# Altium schematic sheet VOLTAGE_REGULATOR.SchDoc
size A; SheetNumber: 4; SheetTotal: 5
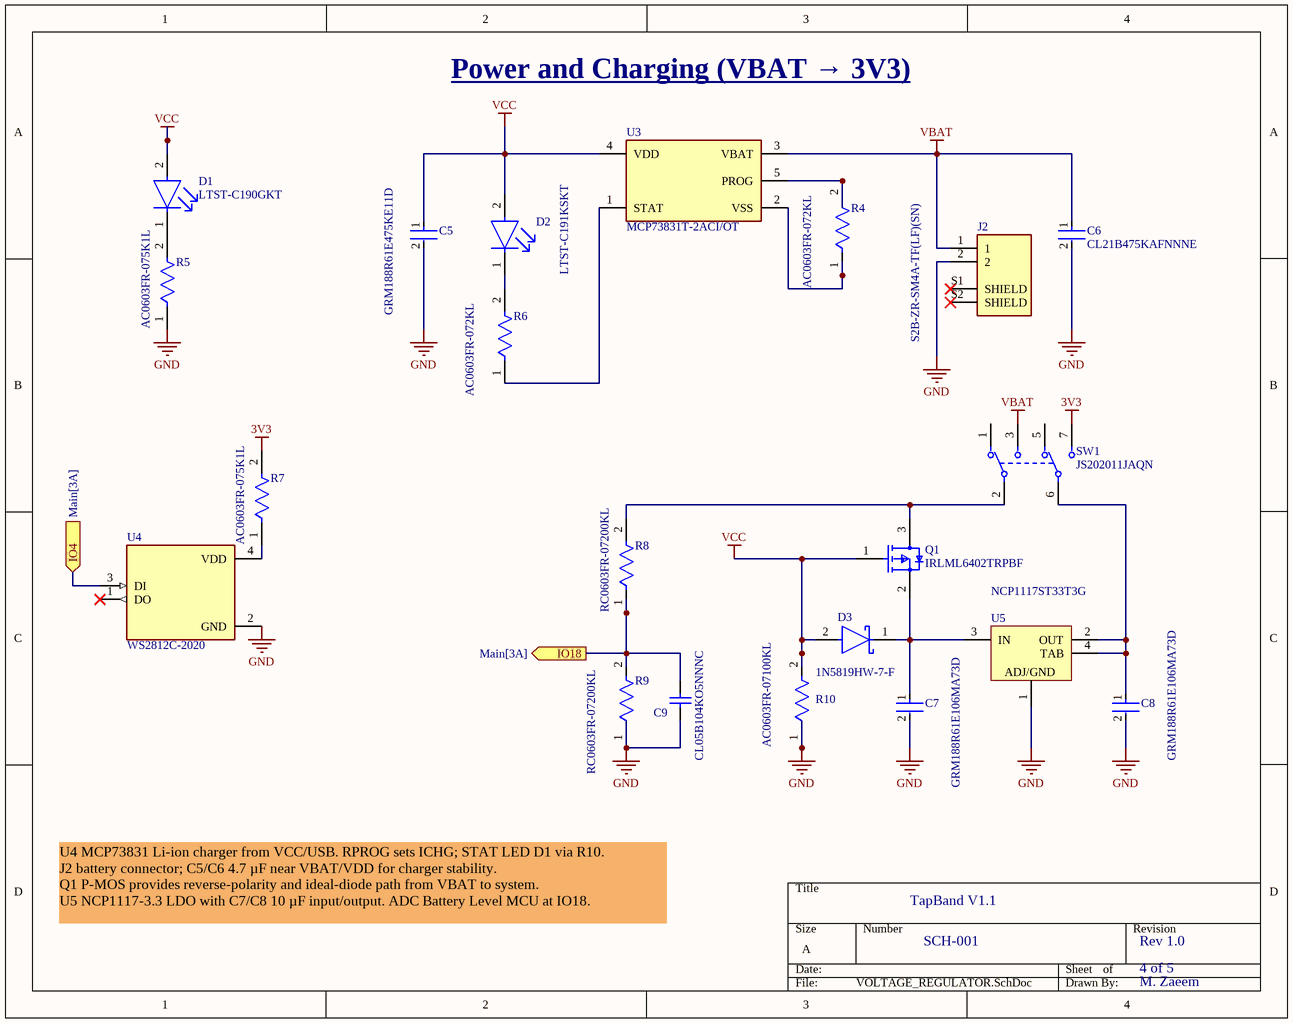
[diagram p0: VOLTAGE_REGULATOR.SchDoc]

## Parts
C5  GRM188R61E475KE11D  [FP-GRM188-0_15-IPC_C]
C6  CL21B475KAFNNNE  [FP-CL21-IPC_C]
C7  GRM188R61E106MA73D  [FP-GRM188-0_2-MFG]
C8  GRM188R61E106MA73D  [FP-GRM188-0_2-MFG]
C9  CL05B104KO5NNNC  [CAPC1050X55X23ML05T13]
D1  LTST-C190GKT  [FP-LTST-C190GKT-MFG]
D2  LTST-C191KSKT  [FP-LTST-C191KSKT-MFG]
D3  1N5819HW-7-F  [FP-SOD123-IPC_A]
J2  S2B-ZR-SM4A-TF(LF)(SN)  [JST_S2B-ZR-SM4A-TF(LF)(SN)]
Q1  IRLML6402TRPBF  [FP-Micro3-MFG]
R4  AC0603FR-072KL  [FP-AC0603-IPC_B]
R5  AC0603FR-075K1L  [FP-AC0603-MFG]
R6  AC0603FR-072KL  [FP-AC0603-IPC_B]
R7  AC0603FR-075K1L  [FP-AC0603-MFG]
R8  RC0603FR-07200KL  [FP-RC0603-0_55-IPC_B]
R9  RC0603FR-07200KL  [FP-RC0603-0_55-IPC_B]
R10  AC0603FR-07100KL  [FP-AC0603-MFG]
SW1  JS202011JAQN  [FP-JS202011JAQN-MFG]
U3  MCP73831T-2ACI/OT  [FP-C04-091-OT-MFG]
U4  WS2812C-2020  [LED_WS2812C-2020]
U5  NCP1117ST33T3G  [ONSC-SOT-223-4-318H-01_A_V]

## Ports
IO4 (in, see Main[3A]), IO18 (out, see Main[3A])

## Nets
3V3: R7.2 SW1.7
GND: C5.2 C6.2 C7.2 C8.2 C9.1 J2.2 R5.1 R9.1 R10.1 U4.2(GND) U5.1(ADJ/GND)
VBAT: C6.1 J2.1 SW1.3 U3.3(VBAT)
VCC: C5.1 D1.2(A) D2.2(A) D3.2(A) Q1.1(G) R10.2 U3.4(VDD)
IO4: U4.3(DI) ; port IO4
IO18: C9.2 R8.1 R9.2 ; port IO18
NetC7_1: C7.1 D3.1(C) Q1.2(S) U5.3(IN)
NetC8_1: C8.1 SW1.6(2_C) U5.2(OUT) U5.4(TAB)
NetD1_1: D1.1(C) R5.2
NetD2_1: D2.1(C) R6.2
NetQ1_3: Q1.3(D) R8.2 SW1.2(1_C)
NetR4_1: R4.1 U3.2(VSS)
NetR4_2: R4.2 U3.5(PROG)
NetR6_1: R6.1 U3.1(STAT)
NetR7_1: R7.1 U4.4(VDD)

Not connected (* = marked no-connect by the designer): J2 S1(SHIELD)* S2(SHIELD)*; SW1 1 5; U4 1(DO)*

## Notes on the sheet
- Power and Charging (VBAT → 3V3)
- TapBand V1.1
- U4 MCP73831 Li‑ion charger from VCC/USB. RPROG sets ICHG; STAT LED D1 via R10.
  J2 battery connector; C5/C6 4.7 µF near VBAT/VDD for charger stability.
  Q1 P‑MOS provides reverse‑polarity and ideal‑diode path from VBAT to system.
  U5 NCP1117‑3.3 LDO with C7/C8 10 µF input/output. ADC Battery Level MCU at IO18.
- SCH-001
- Rev 1.0
- 4 of 5
- M. Zaeem

## Library data of the parts
C5 = CMP-2006-02523-2: Chip Multilayer Ceramic Capacitors for General Purpose, 0603, 4.7uF, X5R, 15%, 10%, 25V; Case Code (Metric): 1608; Max Operating Temperature: 85°C; REACH SVHC: No SVHC; Voltage Rating: 25V; Dielectric: X5R; Packaging: Cut Tape; Width: 0.031inch; Min Operating Temperature: -55°C; Lead Free: Lead Free; Capacitance: 4.7uF; Height: 0.8mm; Case Code (Imperial): 0603; Length: 1.6mm; Voltage Rating (DC): 25V; Case/Package: 0603; Voltage: 25V; Tolerance: 10%; Thickness: 0.031inch; Mount: Surface Mount; Material: Ceramic; Package Quantity: 4000; Depth: 0.8mm
C6 = CMP-13271-001003-1: CL21 Series 0805 4.7uF 25V ±10% Tolerance X7R Multilayer Ceramic Chip Capacitor; Length: 0.079inch; Capacitance: 4.7uF; Max Operating Temperature: 125°C; Mount: Surface Mount; Voltage Rating (DC): 25V; Width: 0.049inch; Min Operating Temperature: -55°C; Lead Free: Lead Free; Case Code (Metric): 2012; Case/Package: 0805; Case Code (Imperial): 0805; Tolerance: 10%; Thickness: 0.053inch; Voltage Rating: 25V; Packaging: Tape and Reel
C7 C8 = CMP-2006-02520-2: Chip Multilayer Ceramic Capacitors for General Purpose, 0603, 10uF, X5R, 15%, 20%, 25V; Tolerance: 20%; Resistor Type: Ceramic; Voltage: 25V; Max Operating Temperature: 85°C; Min Operating Temperature: -55°C; Capacitance: 10uF; Dielectric: X5R; Lead Free: Lead Free; REACH SVHC: No SVHC; Case/Package: 0603; Mount: Surface Mount; Voltage Rating (DC): 25V; Height: 0.8mm; Length: 1.6mm; Thickness: 0.031inch; Width: 0.031inch; Termination: SMD/SMT; Case Code (Imperial): 0603; Case Code (Metric): 1608; Package Quantity: 1; Packaging: Tape and Reel; Depth: 0.8mm; Voltage Rating: 25V; Weight: 0.000222oz; Number of Pins: 2
C9 = CMP-2000-05439-1: Chip Capacitor, 100 nF, +/- 10%, 16 V, -55 to 125 degC, 0402 (1005 Metric), RoHS, Tape and Reel; Manufacturer: Samsung Electro-Mechanics; Capacitance: 100000pF; Dielectric: X7R; Rated Voltage: 16V; Case Size/Dimension: 0402; Tolerance (%): ±10%; Manufacturer URL: http://www.samsungsem.com/global/index.jsp; Datasheet URL: https://datasheet.ciiva.com/29198/458718-da-01-en-vs-kondensator-0402-29198423.pdf; Datasheet Version: Nov-10
D1 = CMP-22017-000005-2: LED GREEN CLEAR CHIP SMD; Dominant Wavelength: 569nm; Reverse Voltage: 5V; Lens Color: Colorless; Viewing Angle: 130°; Voltage: 2V; Forward Current: 30mA; Power Dissipation: 100mW; Luminous Intensity: 6mcd; Number of LEDs: 1; Forward Voltage: 2.1V; Wavelength: 565nm; Test Current: 10mA; Min Operating Temperature: -55°C; Lens Style: Clear; Mount: Surface Mount; Width: 0.8mm; Packaging: Tape and Reel; Lens Transparency: Clear; Case Code (Metric): 1608; Depth: 0.8mm; Case Code (Imperial): 0603; Case/Package: 0603; Number of Pins: 2; Max Operating Temperature: 85°C; Lead Free: Lead Free; Number of Elements: 1; Length: 1.6mm; Height: 0.8mm; Package Quantity: 1; Power Rating: 100mW; Radiation Hardening: No; Illumination Color: Green; Color: Green
D2 = CMP-22017-000025-1: LED YELLOW CLEAR SMD; Dominant Wavelength: 597nm; Power Rating: 75mW; Number of LEDs: 1; Lens Style: Diffused; Forward Current: 30mA; Test Current: 20mA; Forward Voltage: 2.4V; Wavelength: 588nm; Viewing Angle: 130°; Lens Color: Colorless; Reverse Voltage: 5V; Luminous Intensity: 180mcd; Case Code (Imperial): 0603; Width: 0.8mm; Power Dissipation: 75mW; Length: 1.6mm; Illumination Color: Yellow; Number of Pins: 2; Case Code (Metric): 1608; Mount: Surface Mount; Number of Elements: 1; Height: 0.55mm; Lens Transparency: Clear; Depth: 0.8mm; Min Operating Temperature: -55°C; Case/Package: 0603; Radiation Hardening: No; Max Operating Temperature: 85°C; Package Quantity: 1; Packaging: Tape and Reel; Lead Free: Lead Free; Color: Yellow
D3 = CMP-0303-00003-3: DIODE SCHOTTKY 40V 1A SOD123; Forward Voltage: 450mV; Capacitance: 110pF; Max Forward Surge Current (Ifsm): 25A; Peak Reverse Current: 50uA; Polarity: Standard; Element Configuration: Single; Max Power Dissipation: 450mW; Min Operating Temperature: -65°C; Package Quantity: 3000; Contact Plating: Tin; Weight: 0.000353oz; Max Repetitive Reverse Voltage (Vrrm): 40V; Max Reverse Voltage (DC): 40V; Height: 1.25mm; Average Rectified Current: 1A; Width: 1.7mm; Case/Package: SOD-123-2; Lead Free: Lead Free; Max Operating Temperature: 125°C; Current Rating: 1A; Termination: SMD/SMT; Forward Current: 1A; Radiation Hardening: No; Number of Pins: 2; Length: 2.85mm; Voltage Rating (DC): 40V; REACH SVHC: No SVHC; Peak Non-Repetitive Surge Current: 25A; Packaging: Tape and Reel; Output Current: 1A
J2 = S2B-ZR-SM4A-TF(LF)(SN): Connector Header Surface Mount, Right Angle 2 position 0.059 (1.50mm); MF: JST Sales; SnapEDA_Link: https://www.snapeda.com/parts/S2B-ZR-SM4A-TF%20(LF)(SN)/JST/view-part/?ref=snap; Package: None; Value: *; MP: S2B-ZR-SM4A-TF (LF)(SN); Check_prices: https://www.snapeda.com/parts/S2B-ZR-SM4A-TF%20(LF)(SN)/JST/view-part/?ref=eda
Q1 = CMP-32901-000130-1: MOSFET P-CH 20V 3.7A SOT-23; Manufacturer: Infineon; Reverse Recovery Time: 29ns; Max Forward Diode Voltage: -1.2V; Input Capacitace At Vds: 633pF @ -10V; Drain To Source Resistance: 0.05Ω; Gate To Source Voltage: 12V; Max Junction Temp: +150°C; Pulse Drain Current: -22A; Threshold Vgs Min: -0.4V; Turn Off Delay Time: 588ns; Number Of Channels: 1; Power Dissipation: 1.3W; Turn On Delay Time: 350ns; Drain To Source Breakdown Voltage: -20V; Continuous Drain Current: -3.7A; Depletion Mode: False; Gate Charge At Vgs: 8nC @ -5V; Rthja Max: 75°C/W; Threshold Vgs: -0.55V; Standoff Height: 0.01mm; Reverse Recovery Charge: 11nC; Device Class L2: Transistors; Ipc Land Pattern Name: SOT95P237X100-3; Temperature Range High: +150°C; Octopart: https://octopart.com/irlml6402trpbf-infineon-65874989; ComponentLink2URL: https://www.infineon.com/dgdl/irlml6402pbf.pdf?fileId=5546d462533600a401535668d5c2263c; Automotive: No; Manufacturer Part Number: IRLML6402TRPBF; Height: 1.12mm; Drain To Source Voltage: -20V; Digikey Description: MOSFET P-CH 20V 3.7A SOT-23; Device Class L1: Discrete Semiconductors; Package: Micro3; Lead Free: Yes; Temperature Range Low: -55°C; Number Of P Channels: 1; Technology: MOSFET; Temperature: -55°C to +150°C; Category: Trans; Footprint Url: http://irf.com/package/outline/po_micro3.pdf; RoHS: TRUE; Device Class L3: MOSFETs; Threshold Vgs Max: -1.2V; ComponentLink2Description: Datasheet
R4 R6 = CMP-2000-04836-2: RES 2kΩ 1.00% 0.1W 0603; Resistance: 2kR; Voltage Rating: 50V; Max Power Dissipation: 100mW; Temperature Coefficient: 100ppm/°C; Tolerance: 1%; Height: 0.45mm; Case Code (Imperial): 0603; Number of Terminations: 2; Termination: SMD/SMT; Max Operating Temperature: 155°C; Min Operating Temperature: -55°C; Features: Moisture Resistant; Size Code: 0603; Military Standard: Not; Depth: 0.8mm; Lead Free: Lead Free; Ratings: AEC-Q200; Case Code (Metric): 1608; Power Rating: 100mW; Resistor Type: Thick Film; Length: 1.6mm; Case/Package: 0603; Packaging: Tape and Reel; Width: 0.8mm; Construction: Rectangular; Series: AC
R5 R7 = CMP-03412-025080-2: RES 5.1KΩ 1.00% 0.1W 0603; Voltage Rating: 50V; Temperature Coefficient: 100ppm/°C; Resistance: 5.1kR; Max Power Dissipation: 100mW; Tolerance: 1%; Max Operating Temperature: 155°C; Min Operating Temperature: -55°C; Ratings: AEC-Q200; Features: Moisture Resistant; RoHS Compliant: Yes; Number of Terminations: 2; Weight: 7.1E-05oz; Case Code (Imperial): 0603; Resistor Type: Thick Film; Length: 1.6mm; Termination: SMD/SMT; Case Code (Metric): 1608; Packaging: Tape and Reel; Width: 0.8mm; Series: AC; Case/Package: 0603; Power Rating: 100mW; Height: 0.45mm
R8 R9 = CMP-03412-037786-1: RES SMD 200K OHM 1% 1/10W 0603; Temperature Coefficient: 100ppm/°C; Voltage Rating: 50V; Resistance: 200kR; Max Power Dissipation: 100mW; Packaging: Tape and Reel; REACH SVHC: No SVHC; Resistance Tolerance: 1%; Number of Pins: 2; Width: 0.031inch; Termination: SMD/SMT; Features: Moisture Resistant; Tolerance: 1%; Series: RC; Case Code (Imperial): 0603; Depth: 0.8mm; Number of Terminations: 2; Max Operating Temperature: 155°C; Resistor Type: Thick Film; Height: 0.022inch; Lead Free: Lead Free; Construction: Rectangular; Case/Package: 0603; Power Rating: 100mW; Case Code (Metric): 1608; Length: 1.6mm; Size Code: 0603; RoHS Compliant: Yes; Military Standard: Not; Min Operating Temperature: -55°C; Package Quantity: 1; Voltage Rating (DC): 50V
R10 = CMP-2000-04816-3: RES 100KΩ 1.00% 0.1W 0603; Temperature Coefficient: 100ppm/°C; Voltage Rating: 50V; Max Power Dissipation: 100mW; Tolerance: 1%; Working Voltage: 75V; Resistance: 100kR; Min Operating Temperature: -55°C; Case Code (Imperial): 0603; Width: 0.031inch; Max Operating Temperature: 155°C; Military Standard: Not; Technology: THICK FILM; Ratings: AEC-Q200; Features: Moisture Resistant; Construction: Rectangular; Resistor Type: Thick Film; RoHS Compliant: Yes; Case Code (Metric): 1608; Termination: SMD/SMT; Series: AC; Lead Free: Lead Free; Length: 1.6mm; Depth: 0.8mm; Height: 0.022inch; Power Rating: 100mW; Package Quantity: 1; Packaging: Tape and Reel; Case/Package: 0603; Number of Terminations: 2; Moisture Sensitivity Level: 1
SW1 = CMP-10038-000008-2: SWITCH SLIDE DPDT 300MA 6V; Actuator Material: Nylon; Actuator Type: Standard; Electrical Life: 5000Cycles; Actuator Length: 2mm; Switch Function: On-On; Throw Configuration: DPDT; Switch Travel: 2mm; Min Operating Temperature: -40°C; Contact Material: Copper Alloy; Mount: Surface Mount; Voltage Rating (DC): 6V; Max Operating Temperature: 85°C; Current Rating: 300mA; Packaging: Cut Tape; Contact Plating: Silver
U3 = CMP-0133-00143-2: IC CONTROLLR LI-ION 4.2V SOT23-5; Max Power Dissipation: 1.54W; Output Current: 500mA; Max Output Voltage: 4.5V; Number of Outputs: 1; Min Output Voltage: 4.168V; Min Supply Voltage: 3.75V; Max Input Voltage: 6V; Voltage Rating: 4.534V; Drain to Source Resistance: 350mR; Max Operating Temperature: 85°C; Length: 0.122inch; Number of Pins: 5; REACH SVHC: No SVHC; Radiation Hardening: No; Min Operating Temperature: -40°C; Weight: 0.00709oz; Contact Plating: Tin; Termination: SMD/SMT; Case/Package: SOT-23; Mount: Surface Mount; Width: 0.071inch; Packaging: Tape and Reel; Number of Cells: 1; Max Charge Current: 500mA; Height: 0.051inch; Number of Channels: 1; Output Voltage: 4.2V; Max Supply Voltage: 6V; Lead Free: Lead Free
U4 = WS2812C-2020: Intelligent control LED integrated light source; MF: Worldsemi; SnapEDA_Link: https://www.snapeda.com/parts/WS2812C-2020/Worldsemi/view-part/?ref=snap; Package: Package; Value: *; MP: WS2812C-2020; Check_prices: https://www.snapeda.com/parts/WS2812C-2020/Worldsemi/view-part/?ref=eda
U5 = CMP-1679-00010-1: Low-Dropout Positive Fixed Voltage Regulator, 1 A, 3.3 V Output Voltage, 0 to 125 degC, 4-Pin SOT-223 (318H-01), Pb-Free, Tape and Reel; Resistance: 220 kohm; Type (Resistor): Thick Film; Voltage Rating: 75 V; Tolerance: 1%; Case\Package: 0603; Power Rating: 100 mW; Width: 0.85 mm; Weight: 7.1E-05 oz; ComponentLink2URL: http://www.onsemi.com/pub_link/Collateral/NCP1117-D.PDF; RoHSCompliant: true; Height: 0.45 mm; PackageDescription: 4-Pin Small Outline Transistor, Body 6.5 x 3.5 mm, Pitch 2.3 mm; ComponentLink1Description: Manufacturer URL; ComponentLink1URL: http://www.onsemi.com/; PackageReference: SOT-223-4-318H-01_A; Max Operating Temperature: 155 degC; Packaging: Tape and Reel; REACH SVHC: Unknown; Length: 1.55 mm; Package Quantity: 5000; Radiation Hardening: No; Min Operating Temperature: -55 degC; DatasheetVersion: Rev. 27, 09/2014; Mount: Surface Mount; Case Code (Imperial): 0603; Case Code (Metric): 1608; ComponentLink2Description: Datasheet